# EAGLE design Battery (EAGLE 8.4.3)
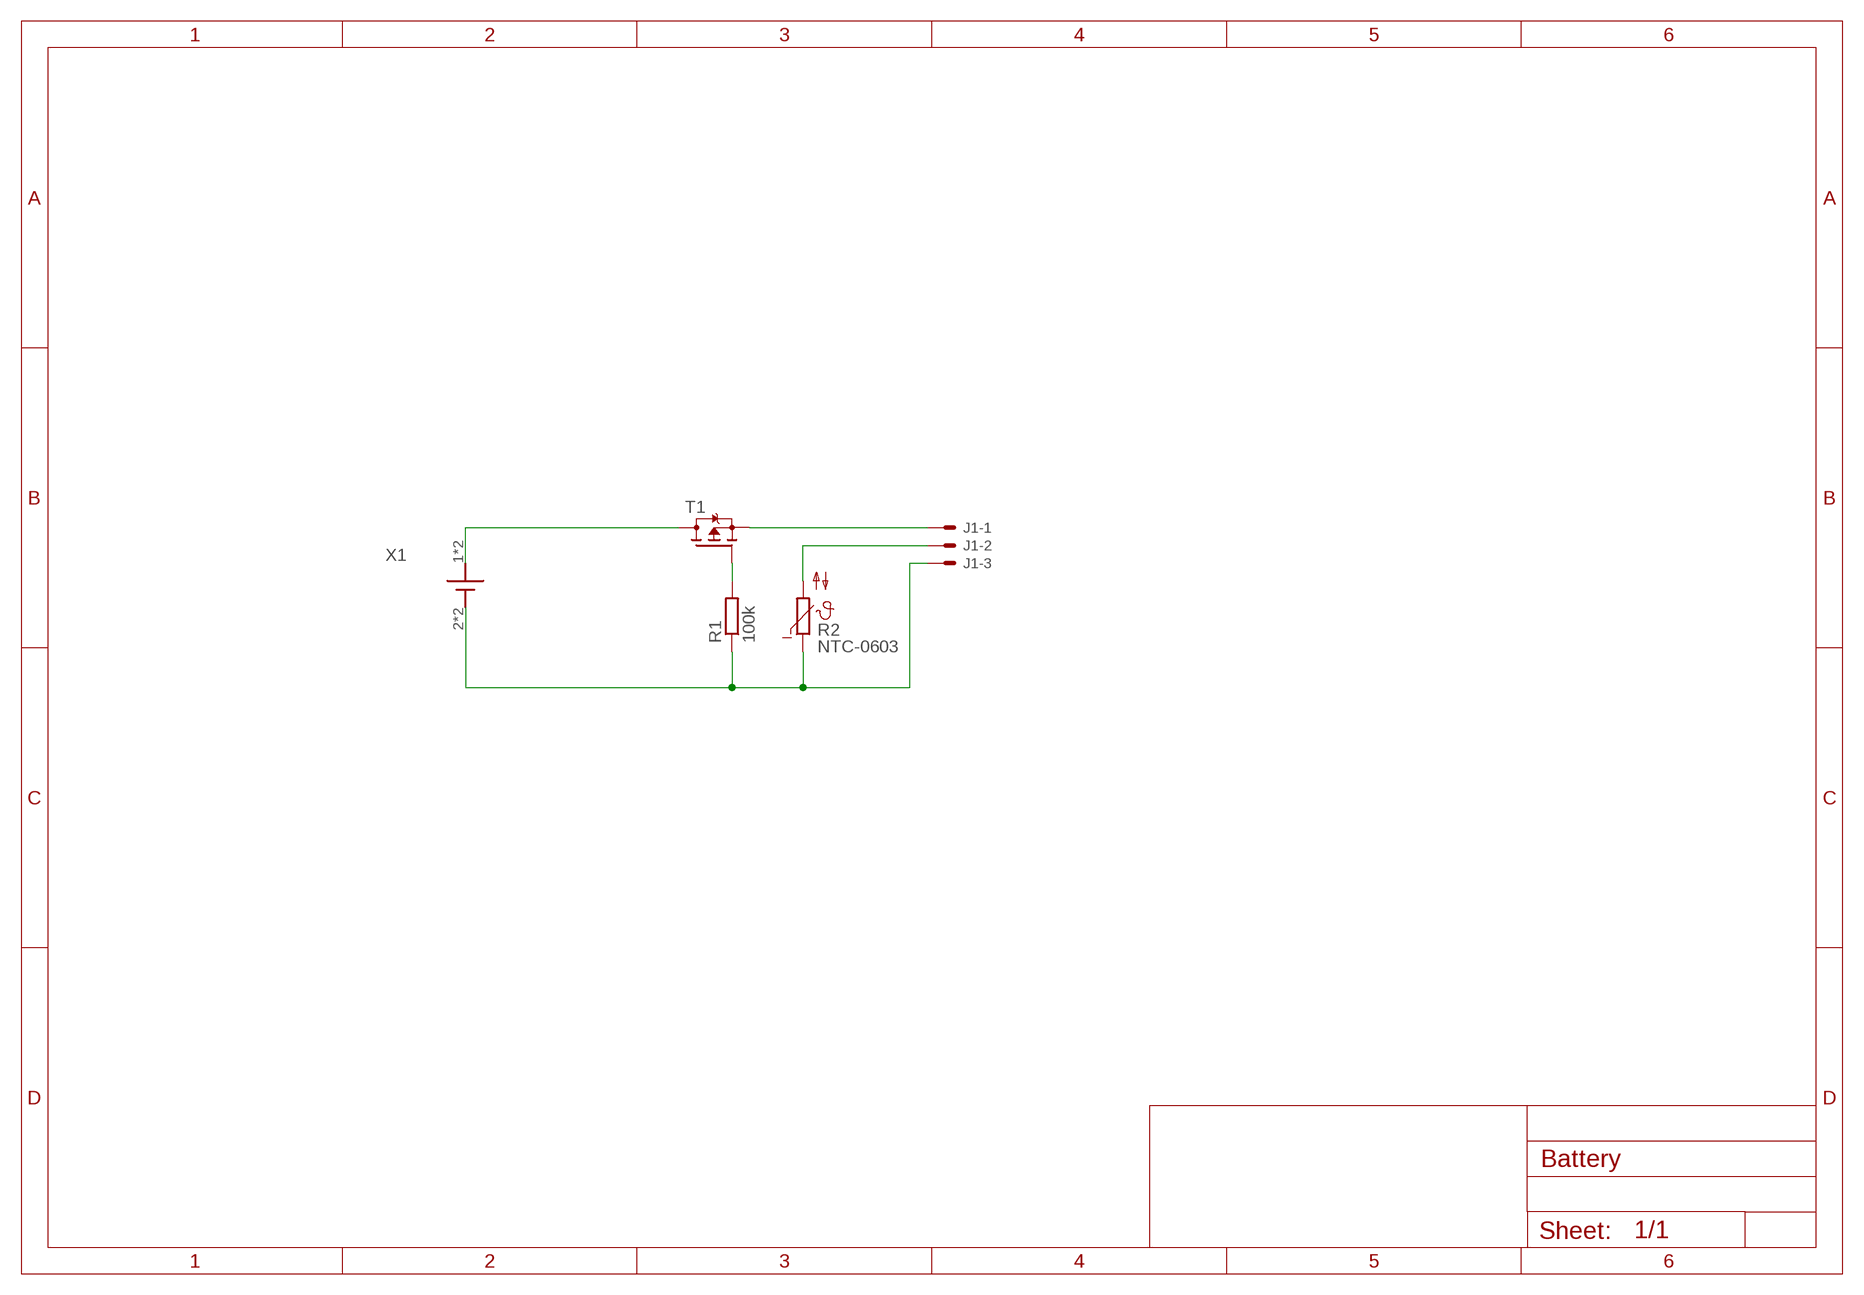
[diagram p0: schematic, sheet 1]

## Parts
J1  22-05-7038-03  [7395-03]
R1  100k  R-EU_R0603  [R0603]
R2  NTC-0603  [R0603]
T1  PMOS  [SOT23]
X1  LI-ION_BATHOL2  [HOLDER_2]

## Nets
BAT: J1.1 T1.2(S)
GND: J1.3 R1.1 R2.1 X1.2(VBAT-1) X1.3(VBAT-1)
N$2: T1.3(D) X1.1(VBAT+1) X1.4(VBAT+1)
N$4: R1.2 T1.1(G)
NTC: J1.2 R2.2

## Library data of the parts
J1 = con-molex:22-?-03: CONNECTOR wire to board 2.54 mm (.1 inch) pitch header; OC_FARNELL: unknown; OC_MOUSER: 538-22-05-7038; OC_NEWARK: unknown
R1 = rcl:R-EU_: RESISTOR, European symbol
R2 = thermo:NTC-0603; OC_MOUSER: 81-NCP18XV103E03RB
T1 = thermo:PMOS: MOSFET-Transistor, p-Kanal, -3.1 A, -20 V, 90 mohm, -4.5 V, -400 mV; OC_MOUSER: 781-SI2301CDS-T1-GE3
X1 = thermo:LI-ION_BAT; OC_MOUSER: 534-1048

## Board
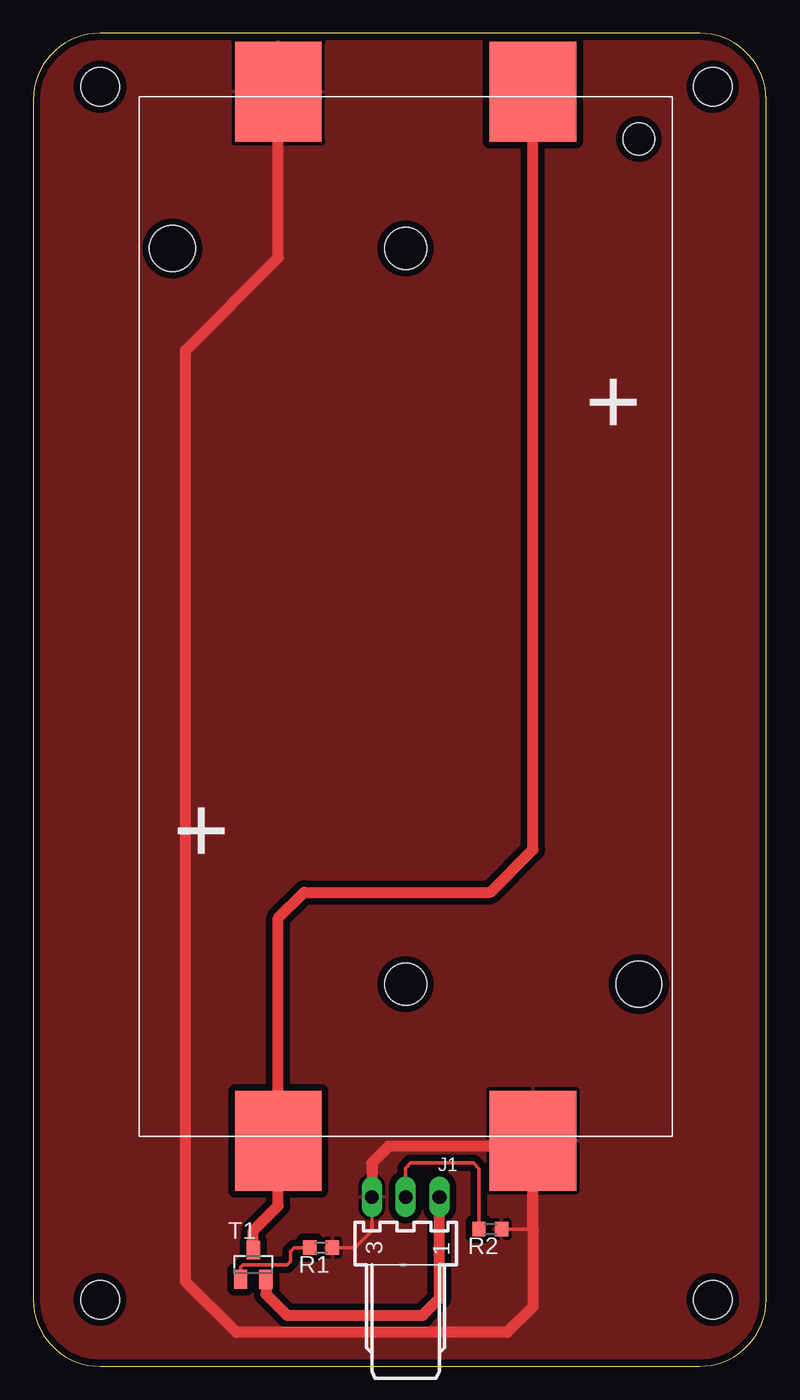
[diagram p1: board, top side]
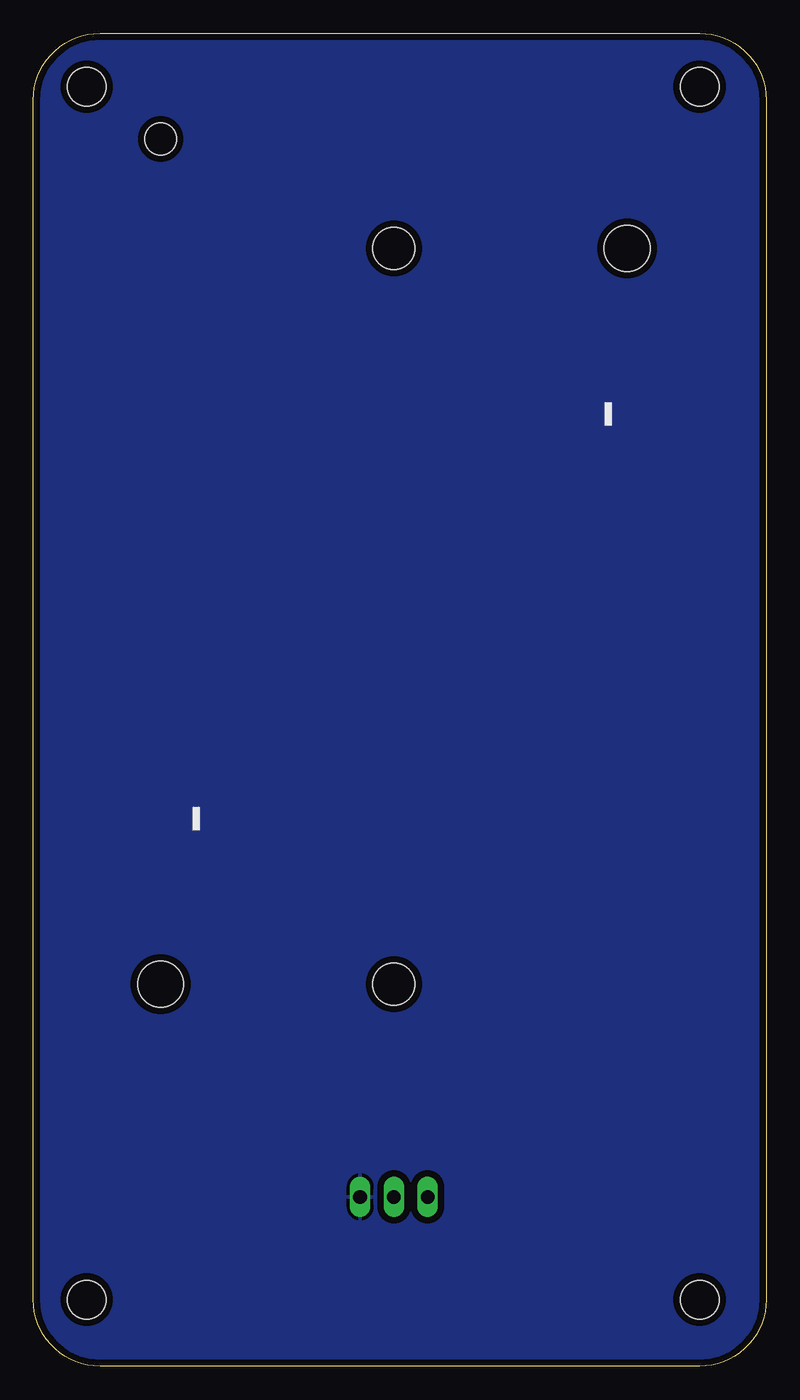
[diagram p2: board, bottom side, seen from below]

Size 55 x 100 mm. Coordinates in mm from the lower left corner, seen from the top.
Outline: 0,95 0,5 arc90 5,0 50,0 arc90 55,5 55,95 arc90 50,100 5,100 arc90 0,95
Copper layers (1*16): Top 0.035mm / dielectric 1.6mm / Bottom 0.035mm
Design rules "Elecrow_2-layer_PCB_eagle_rule": minimum track width 6mil, minimum drill 12mil, track to track 6mil, track to pad 6mil, pad to pad 6mil, via to via 8mil, smd to smd 0mil, copper to edge 20mil, drill to drill 10mil, minimum pad ring 6mil, minimum via ring 6mil, stop-mask expansion 0mil, vias tented up to drill 100mil, thermal gap 10mil
Holes 2.9 mm at 51,96 5,96 5,5 51,5

### Footprints (pad centres in the part's own frame; a part is rotated, then mirrored left to right if it is on the bottom)
7395-03 = drill 1.016 long: 1 2.54,0; 2 0,0; 3 -2.54,0
R0603 = smd 1 x 1.1: 1 -0.85,0; 2 0.85,0
SOT23 = smd 1 x 1.4: 1 -0.95,-1.1; 2 0.95,-1.1; 3 0,1.1
HOLDER_2 = smd 7.5 x 6.5: 1 -39.35,9.555; 2 39.35,9.555; 3 -39.35,-9.555; 4 39.35,-9.555 | hole 3.45: -27.6,-17.505; 27.6,17.505 | hole 2.39: 35.82,-17.505 | hole 3.17: -27.6,0; 27.6,0

### Placement (x,y rotation side)
J1  27.94,12.7 0 top
R1  21.59,8.89 180 top
R2  34.29,10.29 180 top
T1  16.51,7.62 0 top
X1  27.94,56.26 90 top

### Tracks (layer width: path | path; a pad name or v marks a point on that pad's centre or on a via)
BAT
  Top 0.813: T1.2 17.46,5.4 19.05,3.81 29.21,3.81 30.48,5.08 J1.1
  pour Bottom (isolate 0.5): -2.54,102.87 57.15,102.87 57.15,-2.54 -2.54,-2.54
GND
  Top 0.254: R1.1 24.13,8.89 25.4,10.16 J1.3 | R2.1 37.49,10.29
  Top 0.813: X1.2 18.39,83.16 11.43,76.2 11.43,6.35 15.24,2.54 35.56,2.54 37.49,4.47 37.49,10.29 X1.3 37.13,16.51 26.67,16.51 25.4,15.24 J1.3
  pour Top (isolate 0.5): -1.27,101.6 55.88,101.6 55.88,-1.27 -1.27,-1.27
N$2
  Top 0.813: T1.3 16.51,10.16 18.39,12.04 X1.1 18.39,33.62 20.32,35.56 34.29,35.56 37.49,38.77 X1.4
N$4
  Top 0.254: T1.1 15.56,7.43 15.75,7.62 19.05,7.62 19.3,7.87 19.3,8.64 19.56,8.89 R1.2
NTC
  Top 0.254: R2.2 33.44,14.82 33.02,15.24 28.32,15.24 27.94,14.86 J1.2